# EAGLE schematic FPGA_APU (EAGLE 9.6.2)
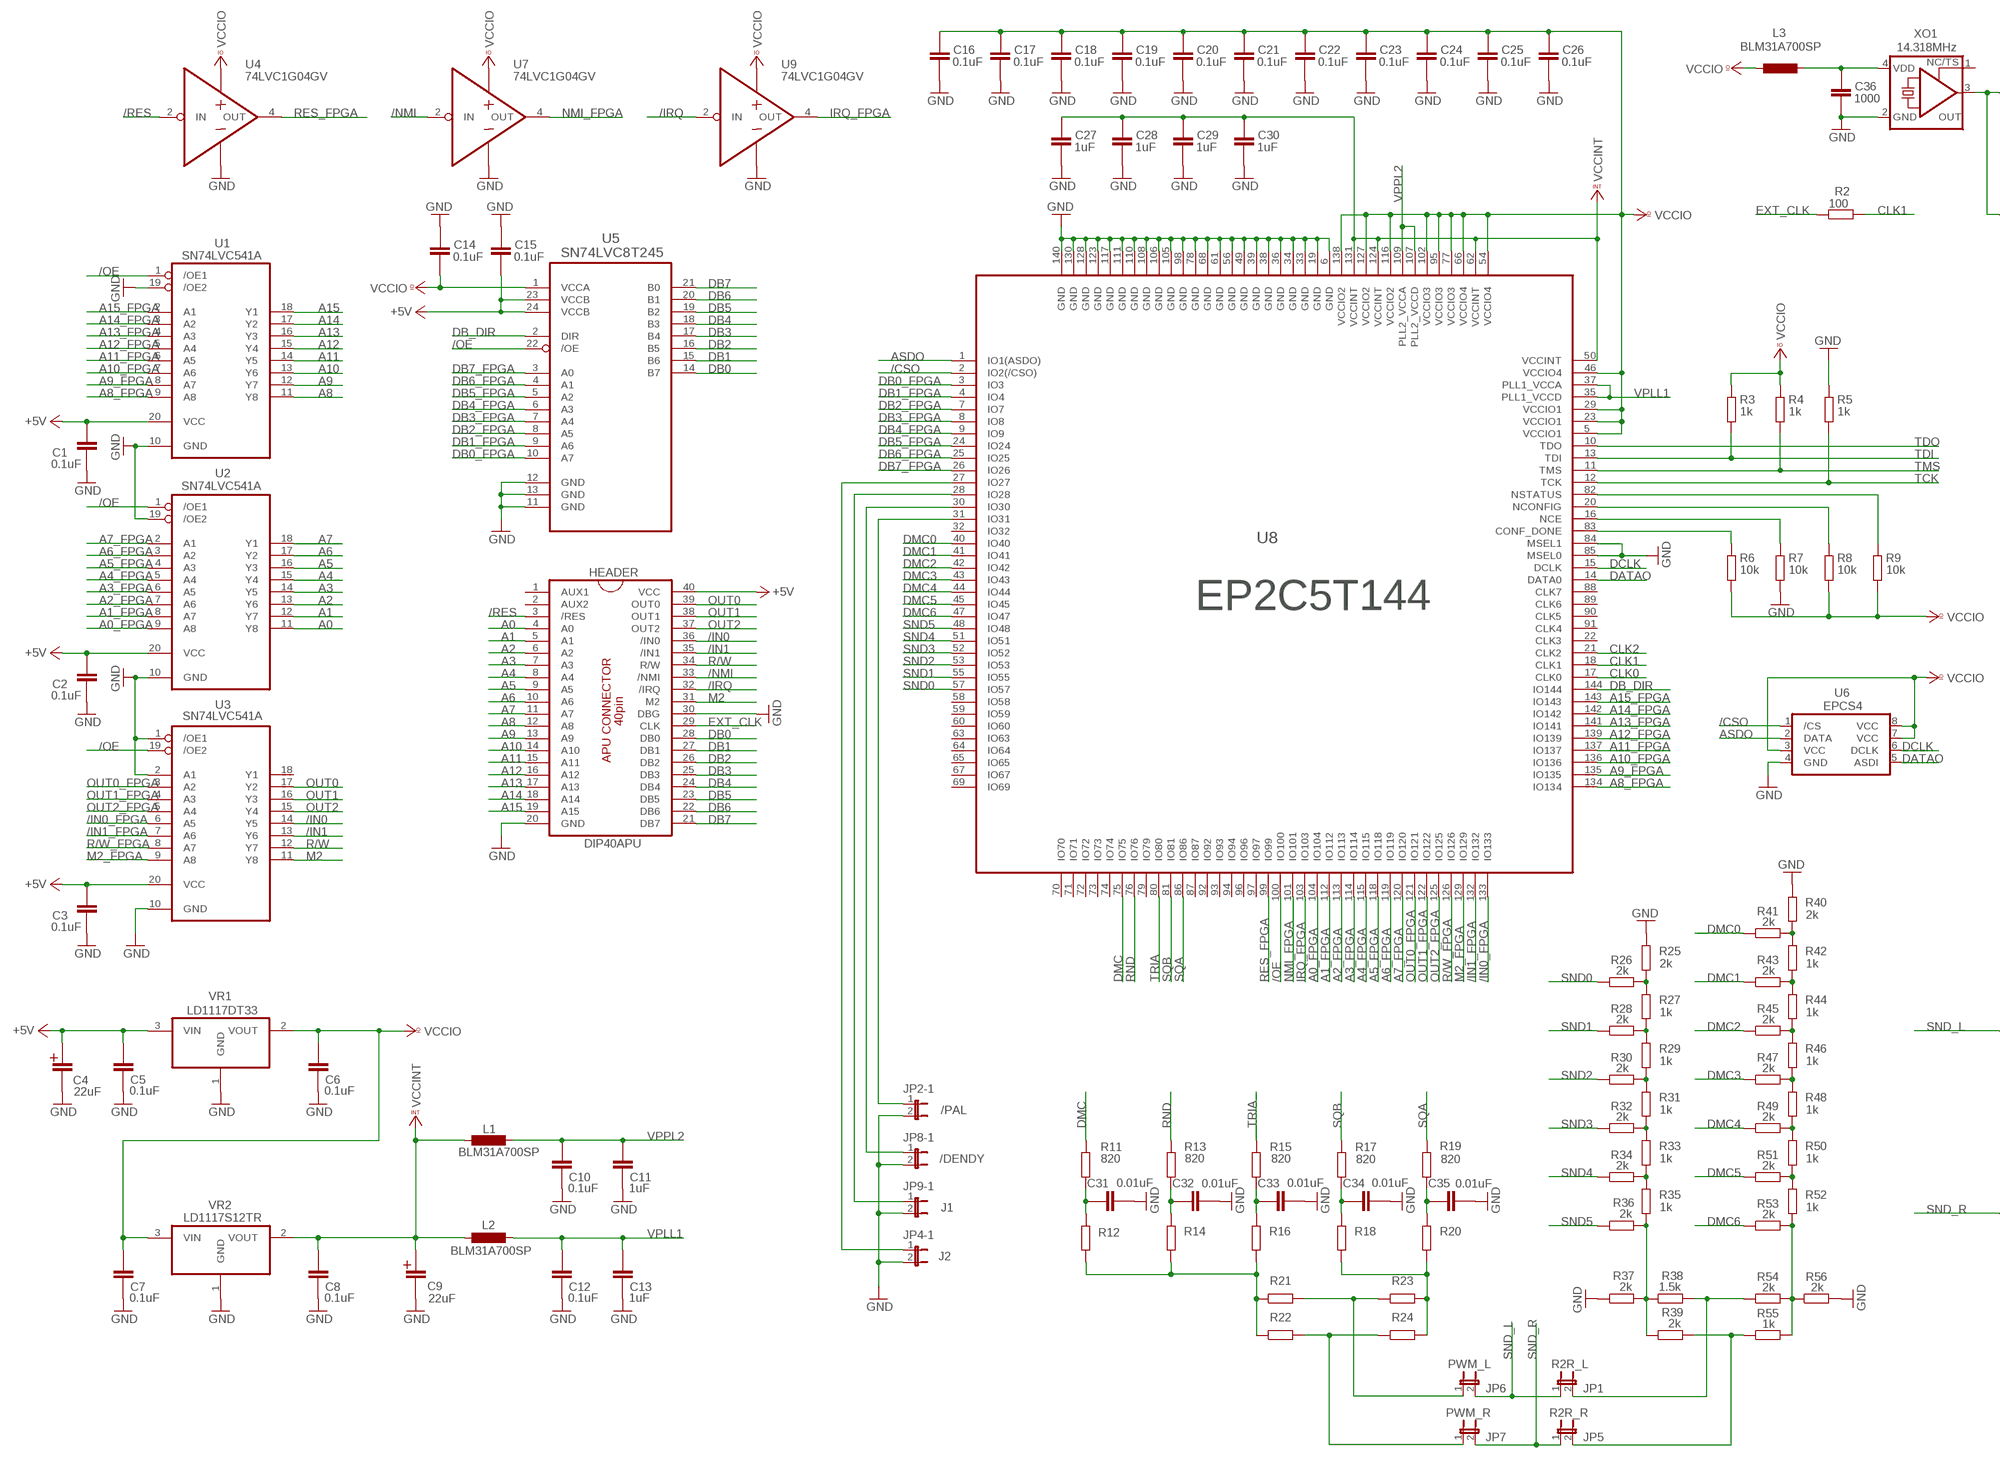
[diagram p0: schematic, sheet 1, part 1 of 2]
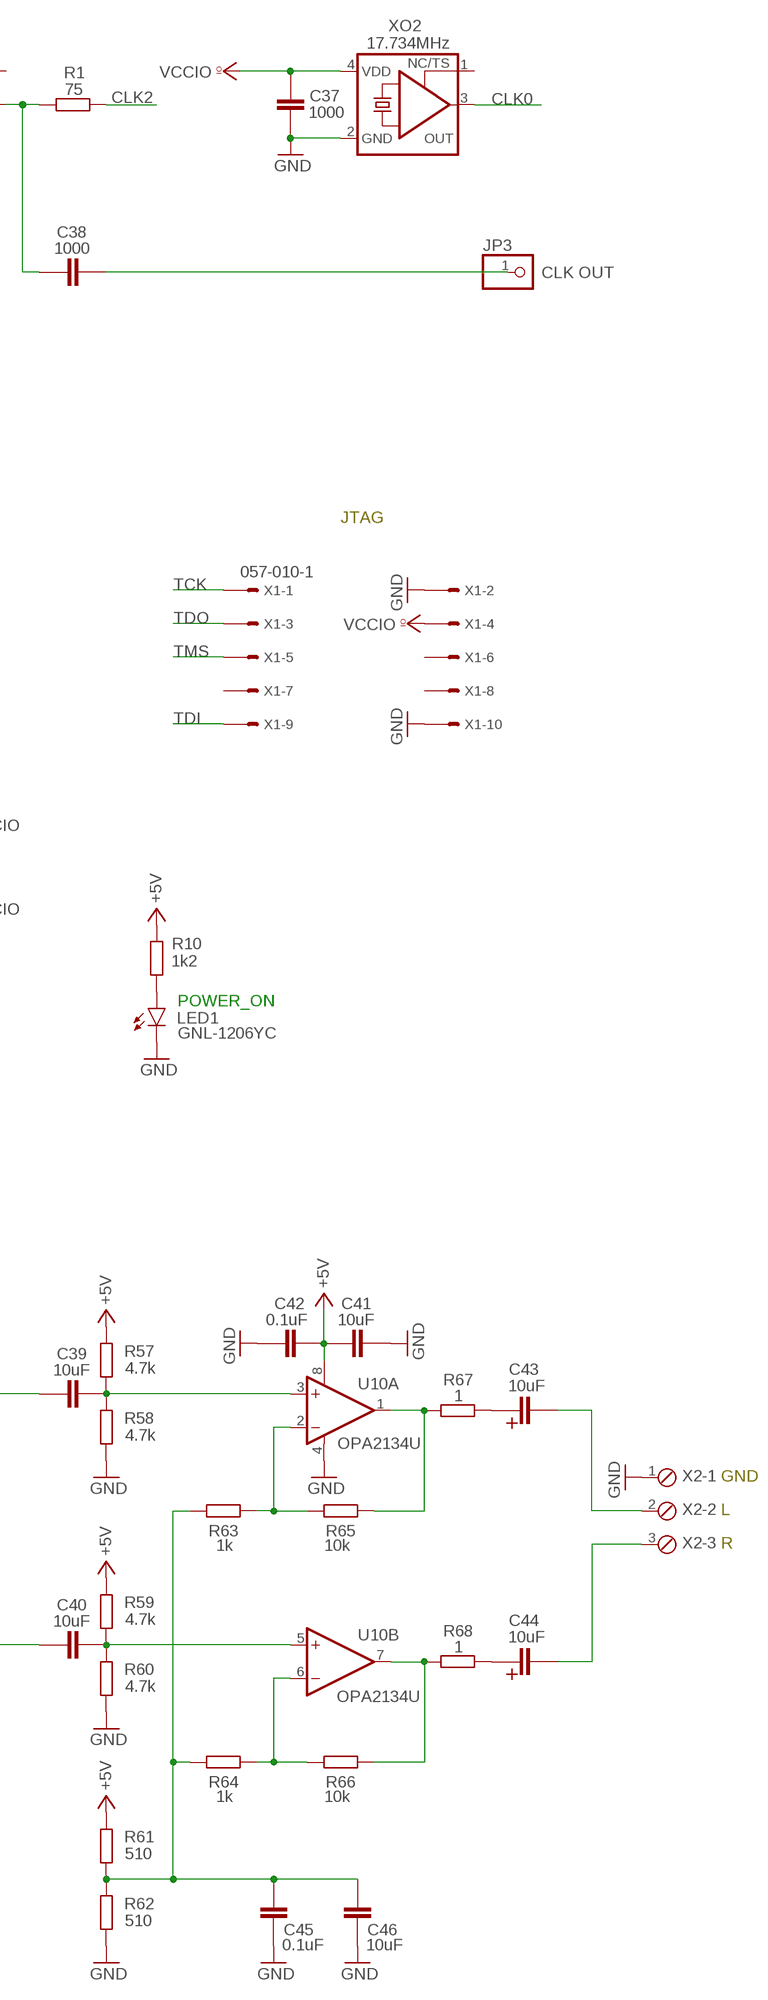
[diagram p1: schematic, sheet 1, part 2 of 2]

## Parts
C1  0.1uF  C-EUC0805  [C0805]
C2  0.1uF  C-EUC0805  [C0805]
C3  0.1uF  C-EUC0805  [C0805]
C4  22uF  CPOL-EU153CLV-0505  [153CLV-0505]
C5  0.1uF  C-EUC0805  [C0805]
C6  0.1uF  C-EUC0805  [C0805]
C7  0.1uF  C-EUC0805  [C0805]
C8  0.1uF  C-EUC0805  [C0805]
C9  22uF  CPOL-EU153CLV-0505  [153CLV-0505]
C10  0.1uF  C-EUC0805  [C0805]
C11  1uF  C-EUC0805  [C0805]
C12  0.1uF  C-EUC0805  [C0805]
C13  1uF  C-EUC0805  [C0805]
C14  0.1uF  C-EUC0805  [C0805]
C15  0.1uF  C-EUC0805  [C0805]
C16  0.1uF  C-EUC0805  [C0805]
C17  0.1uF  C-EUC0805  [C0805]
C18  0.1uF  C-EUC0805  [C0805]
C19  0.1uF  C-EUC0805  [C0805]
C20  0.1uF  C-EUC0805  [C0805]
C21  0.1uF  C-EUC0805  [C0805]
C22  0.1uF  C-EUC0805  [C0805]
C23  0.1uF  C-EUC0805  [C0805]
C24  0.1uF  C-EUC0805  [C0805]
C25  0.1uF  C-EUC0805  [C0805]
C26  0.1uF  C-EUC0805  [C0805]
C27  1uF  C-EUC0805  [C0805]
C28  1uF  C-EUC0805  [C0805]
C29  1uF  C-EUC0805  [C0805]
C30  1uF  C-EUC0805  [C0805]
C31  0.01uF  C-EUC0805  [C0805]
C32  0.01uF  C-EUC0805  [C0805]
C33  0.01uF  C-EUC0805  [C0805]
C34  0.01uF  C-EUC0805  [C0805]
C35  0.01uF  C-EUC0805  [C0805]
C36  1000  C-EUC0805  [C0805]
C37  1000  C-EUC0805  [C0805]
C38  1000  C-EUC0805  [C0805]
C39  10uF  C-EUC0805  [C0805]
C40  10uF  C-EUC0805  [C0805]
C41  10uF  C-EUC0805  [C0805]
C42  0.1uF  C-EUC0805  [C0805]
C43  10uF  CPOL-EU153CLV-0505  [153CLV-0505]
C44  10uF  CPOL-EU153CLV-0505  [153CLV-0505]
C45  0.1uF  C-EUC0805  [C0805]
C46  10uF  C-EUC0805  [C0805]
HEADER  DIP40APU  [DIP-40]
JP1  R2R_L  JP1E  [JP1]
JP2  /PAL  JP4QE  [JP4Q]
JP3  CLK OUT  PINHD-1X1  [1X01]
JP4  J2  JP4QE  [JP4Q]
JP5  R2R_R  JP1E  [JP1]
JP6  PWM_L  JP1E  [JP1]
JP7  PWM_R  JP1E  [JP1]
JP8  /DENDY  JP4QE  [JP4Q]
JP9  J1  JP4QE  [JP4Q]
L1  BLM31A700SP  L-EUL2012C  [L2012C]
L2  BLM31A700SP  L-EUL2012C  [L2012C]
L3  BLM31A700SP  L-EUL2012C  [L2012C]
LED1  GNL-1206YC  LED  [SMARTLED-TTW]
R1  75  R-EU_R0805  [R0805]
R2  100  R-EU_R0805  [R0805]
R3  1k  R-EU_R0805  [R0805]
R4  1k  R-EU_R0805  [R0805]
R5  1k  R-EU_R0805  [R0805]
R6  10k  R-EU_R0805  [R0805]
R7  10k  R-EU_R0805  [R0805]
R8  10k  R-EU_R0805  [R0805]
R9  10k  R-EU_R0805  [R0805]
R10  1k2  R-EU_R0805  [R0805]
R11  820  R-EU_R0805  [R0805]
R12  R-EU_R0805  [R0805]
R13  820  R-EU_R0805  [R0805]
R14  R-EU_R0805  [R0805]
R15  820  R-EU_R0805  [R0805]
R16  R-EU_R0805  [R0805]
R17  820  R-EU_R0805  [R0805]
R18  R-EU_R0805  [R0805]
R19  820  R-EU_R0805  [R0805]
R20  R-EU_R0805  [R0805]
R21  R-EU_R0805  [R0805]
R22  R-EU_R0805  [R0805]
R23  R-EU_R0805  [R0805]
R24  R-EU_R0805  [R0805]
R25  2k  R-EU_R0805  [R0805]
R26  2k  R-EU_R0805  [R0805]
R27  1k  R-EU_R0805  [R0805]
R28  2k  R-EU_R0805  [R0805]
R29  1k  R-EU_R0805  [R0805]
R30  2k  R-EU_R0805  [R0805]
R31  1k  R-EU_R0805  [R0805]
R32  2k  R-EU_R0805  [R0805]
R33  1k  R-EU_R0805  [R0805]
R34  2k  R-EU_R0805  [R0805]
R35  1k  R-EU_R0805  [R0805]
R36  2k  R-EU_R0805  [R0805]
R37  2k  R-EU_R0805  [R0805]
R38  1.5k  R-EU_R0805  [R0805]
R39  2k  R-EU_R0805  [R0805]
R40  2k  R-EU_R0805  [R0805]
R41  2k  R-EU_R0805  [R0805]
R42  1k  R-EU_R0805  [R0805]
R43  2k  R-EU_R0805  [R0805]
R44  1k  R-EU_R0805  [R0805]
R45  2k  R-EU_R0805  [R0805]
R46  1k  R-EU_R0805  [R0805]
R47  2k  R-EU_R0805  [R0805]
R48  1k  R-EU_R0805  [R0805]
R49  2k  R-EU_R0805  [R0805]
R50  1k  R-EU_R0805  [R0805]
R51  2k  R-EU_R0805  [R0805]
R52  1k  R-EU_R0805  [R0805]
R53  2k  R-EU_R0805  [R0805]
R54  2k  R-EU_R0805  [R0805]
R55  1k  R-EU_R0805  [R0805]
R56  2k  R-EU_R0805  [R0805]
R57  4.7k  R-EU_R0805  [R0805]
R58  4.7k  R-EU_R0805  [R0805]
R59  4.7k  R-EU_R0805  [R0805]
R60  4.7k  R-EU_R0805  [R0805]
R61  510  R-EU_R0805  [R0805]
R62  510  R-EU_R0805  [R0805]
R63  1k  R-EU_R0805  [R0805]
R64  1k  R-EU_R0805  [R0805]
R65  10k  R-EU_R0805  [R0805]
R66  10k  R-EU_R0805  [R0805]
R67  1  R-EU_R0805  [R0805]
R68  1  R-EU_R0805  [R0805]
U1  SN74LVC541A  [TSOP20]
U2  SN74LVC541A  [TSOP20]
U3  SN74LVC541A  [TSOP20]
U4  74LVC1G04GV  [SOT95P275X110-5N]
U5  SN74LVC8T245  [SOP65P640X110-24N]
U6  EPCS4  [SO08]
U7  74LVC1G04GV  [SOT95P275X110-5N]
U8  EP2C5T144  [TQFP144]
U9  74LVC1G04GV  [SOT95P275X110-5N]
U10  OPA2134U  [SO08]
VR1  LD1117DT33  [DPAK456P1010X240-3N]
VR2  LD1117S12TR  [SOT-223-3]
X1  057-010-1  [057-010-1]
X2  OUT  MPT7  [7POL254]
XO1  14.318MHz  KXO-PXO/XO-V97  [7.0X5.08_KXO-(V)97]
XO2  17.734MHz  KXO-PXO/XO-V95  [2.5X2.0_KXO-V95]

## Nets
+5V: C1.1 C2.1 C3.1 C4.+ C5.1 C15.2 C41.1 C42.2 HEADER.40(VCC) R10.2 R57.1 R59.1 R61.1 U1.20(VCC) U2.20(VCC) U3.20(VCC) U5.23(VCCB) U5.24(VCCB) U10.8(A:V+) VR1.3(VIN)
/CSO: U6.1(/CS) U8.2(IO2(/CSO))
/IN0: HEADER.36(/IN0) U3.14(Y5)
/IN0_FPGA: U3.6(A5) U8.133(IO133)
/IN1: HEADER.35(/IN1) U3.13(Y6)
/IN1_FPGA: U3.7(A6) U8.132(IO132)
/IRQ: HEADER.32(/IRQ) U9.2(IN)
/NMI: HEADER.33(/NMI) U7.2(IN)
/OE: U1.1(/OE1) U2.1(/OE1) U3.19(/OE2) U5.22(/OE) U8.100(IO100)
/RES: HEADER.3(/RES) U4.2(IN)
A0: HEADER.4(A0) U2.11(Y8)
A0_FPGA: U2.9(A8) U8.104(IO104)
A1: HEADER.5(A1) U2.12(Y7)
A1_FPGA: U2.8(A7) U8.112(IO112)
A2: HEADER.6(A2) U2.13(Y6)
A2_FPGA: U2.7(A6) U8.113(IO113)
A3: HEADER.7(A3) U2.14(Y5)
A3_FPGA: U2.6(A5) U8.114(IO114)
A4: HEADER.8(A4) U2.15(Y4)
A4_FPGA: U2.5(A4) U8.115(IO115)
A5: HEADER.9(A5) U2.16(Y3)
A5_FPGA: U2.4(A3) U8.118(IO118)
A6: HEADER.10(A6) U2.17(Y2)
A6_FPGA: U2.3(A2) U8.119(IO119)
A7: HEADER.11(A7) U2.18(Y1)
A7_FPGA: U2.2(A1) U8.120(IO120)
A8: HEADER.12(A8) U1.11(Y8)
A8_FPGA: U1.9(A8) U8.134(IO134)
A9: HEADER.13(A9) U1.12(Y7)
A9_FPGA: U1.8(A7) U8.135(IO135)
A10: HEADER.14(A10) U1.13(Y6)
A10_FPGA: U1.7(A6) U8.136(IO136)
A11: HEADER.15(A11) U1.14(Y5)
A11_FPGA: U1.6(A5) U8.137(IO137)
A12: HEADER.16(A12) U1.15(Y4)
A12_FPGA: U1.5(A4) U8.139(IO139)
A13: HEADER.17(A13) U1.16(Y3)
A13_FPGA: U1.4(A3) U8.141(IO141)
A14: HEADER.18(A14) U1.17(Y2)
A14_FPGA: U1.3(A2) U8.142(IO142)
A15: HEADER.19(A15) U1.18(Y1)
A15_FPGA: U1.2(A1) U8.143(IO143)
ASDO: U6.2(DATA) U8.1(IO1(ASDO))
CLK0: U8.17(CLK0) XO2.3(OUT)
CLK1: R2.2 U8.18(CLK1)
CLK2: R1.2 U8.21(CLK2)
DATAO: U6.5(ASDI) U8.14(DATA0)
DB0: HEADER.28(DB0) U5.14(B7)
DB0_FPGA: U5.10(A7) U8.3(IO3)
DB1: HEADER.27(DB1) U5.15(B6)
DB1_FPGA: U5.9(A6) U8.4(IO4)
DB2: HEADER.26(DB2) U5.16(B5)
DB2_FPGA: U5.8(A5) U8.7(IO7)
DB3: HEADER.25(DB3) U5.17(B4)
DB3_FPGA: U5.7(A4) U8.8(IO8)
DB4: HEADER.24(DB4) U5.18(B3)
DB4_FPGA: U5.6(A3) U8.9(IO9)
DB5: HEADER.23(DB5) U5.19(B2)
DB5_FPGA: U5.5(A2) U8.24(IO24)
DB6: HEADER.22(DB6) U5.20(B1)
DB6_FPGA: U5.4(A1) U8.25(IO25)
DB7: HEADER.21(DB7) U5.21(B0)
DB7_FPGA: U5.3(A0) U8.26(IO26)
DB_DIR: U5.2(DIR) U8.144(IO144)
DCLK: U6.6(DCLK) U8.15(DCLK)
DMC: R11.1 U8.75(IO75)
DMC0: R41.1 U8.40(IO40)
DMC1: R43.1 U8.41(IO41)
DMC2: R45.1 U8.42(IO42)
DMC3: R47.1 U8.43(IO43)
DMC4: R49.1 U8.44(IO44)
DMC5: R51.1 U8.45(IO45)
DMC6: R53.1 U8.47(IO47)
EXT_CLK: HEADER.29(CLK) R2.1
GND: C1.2 C2.2 C3.2 C4.- C5.2 C6.2 C7.2 C8.2 C9.- C10.2 C11.2 C12.2 C13.2 C14.1 C15.1 C16.2 C17.2 C18.2 C19.2 C20.2 C21.2 C22.2 C23.2 C24.2 C25.2 C26.2 C27.2 C28.2 C29.2 C30.2 C31.2 C32.2 C33.2 C34.2 C35.2 C36.2 C37.2 C41.2 C42.1 C45.2 C46.2 HEADER.20(GND) HEADER.30(DBG) JP2.2 JP4.2 JP8.2 JP9.2 LED1.C@1(C) R5.1 R7.2 R25.1 R37.1 R40.1 R56.2 R58.2 R60.2 R62.2 U1.10(GND) U1.19(/OE2) U2.10(GND) U2.19(/OE2) U3.1(/OE1) U3.2(A1) U3.10(GND) U4.3(GND) U5.11(GND) U5.12(GND) U5.13(GND) U6.4(GND) U7.3(GND) U8.6(GND) U8.19(GND) U8.33(GND) U8.34(GND) U8.36(GND) U8.38(GND) U8.39(GND) U8.49(GND) U8.56(GND) U8.61(GND) U8.68(GND) U8.78(GND) U8.84(MSEL1) U8.85(MSEL0) U8.98(GND) U8.105(GND) U8.106(GND) U8.108(GND) U8.110(GND) U8.111(GND) U8.117(GND) U8.123(GND) U8.128(GND) U8.130(GND) U8.140(GND) U9.3(GND) U10.4(A:V-) VR1.1(GND) VR2.1(GND) X1.2 X1.10 X2.1 XO1.2(GND) XO2.2(GND)
IRQ_FPGA: U8.103(IO103) U9.4(OUT)
M2: HEADER.31(M2) U3.11(Y8)
M2_FPGA: U3.9(A8) U8.129(IO129)
N$1: R25.2 R26.2 R27.1
N$2: C38.2 JP3.1
N$3: R64.2 R66.1 U10.6(B:-IN)
N$4: C43.- X2.2
N$5: LED1.A@1(A) R10.1
N$6: C38.1 R1.1 XO1.3(OUT)
N$7: R7.1 U8.16(NCE)
N$8: JP2.1 U8.31(IO31)
N$9: R27.2 R28.2 R29.1
N$10: R29.2 R30.2 R31.1
N$11: C44.- X2.3
N$12: R31.2 R32.2 R33.1
N$13: R33.2 R34.2 R35.1
N$14: JP8.1 U8.30(IO30)
N$15: JP9.1 U8.28(IO28)
N$16: JP4.1 U8.27(IO27)
N$17: R40.2 R41.2 R42.1
N$18: R42.2 R43.2 R44.1
N$19: R52.2 R53.2 R54.2 R55.2 R56.1
N$20: R9.1 U8.82(NSTATUS)
N$21: R8.1 U8.20(NCONFIG)
N$22: R6.1 U8.83(CONF_DONE)
N$23: R44.2 R45.2 R46.1
N$24: C36.1 L3.2 XO1.4(VDD)
N$25: R46.2 R47.2 R48.1
N$26: R48.2 R49.2 R50.1
N$27: R50.2 R51.2 R52.1
N$28: JP1.2 R38.2 R54.1
N$29: JP5.2 R39.2 R55.1
N$31: R35.2 R36.2 R37.2 R38.1 R39.1
N$32: C31.1 R11.2 R12.1
N$33: R12.2 R14.2 R16.2 R21.1 R22.1
N$34: C32.1 R13.2 R14.1
N$35: R18.2 R20.2 R23.2 R24.2
N$36: C33.1 R15.2 R16.1
N$37: C43.+ R67.2
N$38: C34.1 R17.2 R18.1
N$39: JP6.1 R21.2 R23.1
N$40: C35.1 R19.2 R20.1
N$41: JP7.1 R22.2 R24.1
N$42: R63.2 R65.1 U10.2(A:-IN)
N$43: R65.2 R67.1 U10.1(A:OUT)
N$44: R66.2 R68.1 U10.7(B:OUT)
N$46: C39.2 R57.2 R58.1 U10.3(A:+IN)
N$47: C40.2 R59.2 R60.1 U10.5(B:+IN)
N$48: C44.+ R68.2
NMI_FPGA: U7.4(OUT) U8.101(IO101)
OUT0: HEADER.39(OUT0) U3.17(Y2)
OUT0_FPGA: U3.3(A2) U8.121(IO121)
OUT1: HEADER.38(OUT1) U3.16(Y3)
OUT1_FPGA: U3.4(A3) U8.122(IO122)
OUT2: HEADER.37(OUT2) U3.15(Y4)
OUT2_FPGA: U3.5(A4) U8.125(IO125)
R/W: HEADER.34(R/W) U3.12(Y7)
R/W_FPGA: U3.8(A7) U8.126(IO126)
RES_FPGA: U4.4(OUT) U8.99(IO99)
RND: R13.1 U8.76(IO76)
SND0: R26.1 U8.57(IO57)
SND1: R28.1 U8.55(IO55)
SND2: R30.1 U8.53(IO53)
SND3: R32.1 U8.52(IO52)
SND4: R34.1 U8.51(IO51)
SND5: R36.1 U8.48(IO48)
SND_L: C39.1 JP1.1 JP6.2
SND_R: C40.1 JP5.1 JP7.2
SQA: R19.1 U8.86(IO86)
SQB: R17.1 U8.81(IO81)
TCK: R5.2 U8.12(TCK) X1.1
TDI: R3.2 U8.13(TDI) X1.9
TDO: U8.10(TDO) X1.3
TMS: R4.2 U8.11(TMS) X1.5
TRIA: R15.1 U8.80(IO80)
VCCINT: C8.1 C9.+ C27.1 C28.1 C29.1 C30.1 L1.2 L2.1 U8.50(VCCINT) U8.62(VCCINT) U8.124(VCCINT) U8.131(VCCINT) VR2.2(VOUT)
VCCIO: C6.1 C7.1 C14.2 C16.1 C17.1 C18.1 C19.1 C20.1 C21.1 C22.1 C23.1 C24.1 C25.1 C26.1 C37.1 L3.1 R3.1 R4.1 R6.2 R8.2 R9.2 U4.5(VCC) U5.1(VCCA) U6.3(VCC) U6.7(VCC) U6.8(VCC) U7.5(VCC) U8.5(VCCIO1) U8.23(VCCIO1) U8.29(VCCIO1) U8.46(VCCIO4) U8.54(VCCIO4) U8.66(VCCIO4) U8.77(VCCIO3) U8.95(VCCIO3) U8.102(VCCIO3) U8.116(VCCIO2) U8.127(VCCIO2) U8.138(VCCIO2) U9.5(VCC) VR1.2(VOUT) VR2.3(VIN) X1.4 XO2.4(VDD)
VPLL1: C12.1 C13.1 L2.2 U8.35(PLL1_VCCD) U8.37(PLL1_VCCA)
VPPL2: C10.1 C11.1 L1.1 U8.107(PLL2_VCCD) U8.109(PLL2_VCCA)
VPPL3: C45.1 C46.1 R61.2 R62.1 R63.1 R64.1
Unconnected: HEADER.1(AUX1) HEADER.2(AUX2) JP2.3 JP2.4 JP2.5 JP2.6 JP2.7 JP2.8 JP4.3 JP4.4 JP4.5 JP4.6 JP4.7 JP4.8 JP8.3 JP8.4 JP8.5 JP8.6 JP8.7 JP8.8 JP9.3 JP9.4 JP9.5 JP9.6 JP9.7 JP9.8 U3.18(Y1) U8.22(CLK3) U8.32(IO32) U8.58(IO58) U8.59(IO59) U8.60(IO60) U8.63(IO63) U8.64(IO64) U8.65(IO65) U8.67(IO67) U8.69(IO69) U8.70(IO70) U8.71(IO71) U8.72(IO72) U8.73(IO73) U8.74(IO74) U8.79(IO79) U8.87(IO87) U8.88(CLK7) U8.89(CLK6) U8.90(CLK5) U8.91(CLK4) U8.92(IO92) U8.93(IO93) U8.94(IO94) U8.96(IO96) U8.97(IO97) X1.6 X1.7 X1.8 X2.4 X2.5 X2.6 X2.7 XO1.1(TS) XO2.1(TS)

## Notes on the sheet
- JTAG
- POWER_ON
- GND
- L
- R

## Library data of the parts
C1-C3 C5-C8 C10-C42 C45 C46 = rcl_my:C-EU: CAPACITOR, European symbol; SPICEPREFIX: C
C4 C9 C43 C44 = rcl_my:CPOL-EU: POLARIZED CAPACITOR, European symbol; SPICEPREFIX: C
HEADER = SnapEDA-Library:DIP40APU
JP1 JP5-JP7 = jumper:JP1E: JUMPER
JP2 JP4 JP8 JP9 = jumper:JP4QE: JUMPER
JP3 = pinhead:PINHD-1X1: PIN HEADER
L1-L3 = rcl:L-EU: INDUCTOR, European symbol; SPICEPREFIX: L
LED1 = led:LED: LED OSRAM: - CHIPLED LG R971, LG N971, LY N971, LG Q971, LY Q971, LO R971, LY R971 LH N974, LH R974 LS Q976, LO Q976, LY Q976 LO Q996 - Hyper CHIPLED LW Q18S LB Q993, LB Q99A, LB R99A - SideLED LS A670, LO A670, LY A670, LG A670, LP A670 LB A673, LV A673, LT A673, LW A673 LH A674 LY A675 LS A676, LA A676, LO A676, LY A676, LW A676 LS A679, LY A679, LG A679 - Hyper Micro SIDELED® LS Y876, LA Y876, LO Y876, LY Y876 LT Y87S - SmartLED LW L88C, LW L88S LB L89C, LB L89S, LG L890 LS L89K, LO L89K, LY L89K LS L896, LA L896, LO L896, LY L896 - TOPLED LS T670, LO T670, LY T670, LG T670, LP T670 LSG T670, LSP T670, LSY T670, LOP T670, LYG T670 LG T671, LOG T671, LSG T671 LB T673, LV T673, LT T673, LW T673 LH T674 LS T676, LA T676, LO T676, LY T676, LB T676, LH T676, LSB T676, LW T676 LB T67C, LV T67C, LT T67C, LS T67K, LO T67K, LY T67K, LW E67C LS E67B, LA E67B, LO E67B, LY E67B, LB E67C, LV E67C, LT E67C LW T67C LS T679, LY T679, LG T679 LS T770, LO T770, LY T770, LG T770, LP T770 LB T773, LV T773, LT T773, LW T773 LH T774 LS E675, LA E675, LY E675, LS T675 LS T776, LA T776, LO T776, LY T776, LB T776 LHGB T686 LT T68C, LB T68C - Hyper Mini TOPLED® LB M676 - Mini TOPLED Santana® LG M470 LS M47K, LO M47K, LY M47K Source: http://www.osram.convergy.de LUXEON: - LUMILED® LXK2-PW12-R00, LXK2-PW12-S00, LXK2-PW14-U00, LXK2-PW14-V00 LXK2-PM12-R00, LXK2-PM12-S00, LXK2-PM14-U00 LXK2-PE12-Q00, LXK2-PE12-R00, LXK2-PE12-S00, LXK2-PE14-T00, LXK2-PE14-U00 LXK2-PB12-K00, LXK2-PB12-L00, LXK2-PB12-M00, LXK2-PB14-N00, LXK2-PB14-P00, LXK2-PB14-Q00 LXK2-PR12-L00, LXK2-PR12-M00, LXK2-PR14-Q00, LXK2-PR14-R00 LXK2-PD12-Q00, LXK2-PD12-R00, LXK2-PD12-S00 LXK2-PH12-R00, LXK2-PH12-S00 LXK2-PL12-P00, LXK2-PL12-Q00, LXK2-PL12-R00 Source: www.luxeon.com KINGBRIGHT: KA-3528ASYC Source: www.kingbright.com
R1-R68 = rcl:R-EU_: RESISTOR, European symbol; SPICEPREFIX: R
U1-U3 = SnapEDA-Library:SN74LVC541A; PACKAGE: TSSOP-20; SUPPLIER: TI
U4 U7 U9 = 74LVC1G04GV:74LVC1G04GV
U5 = SnapEDA-Library:SN74LVC8T245
U6 = EPCS4:EPCS4
U8 = altera-cyclone-II:EP2C5T144: EP2C5T144 Auto generated by make-symbol-device-package-bsdl.ulp Rev. 19 Tip: Use split-device-symbol.ulp to generate a Device with multiple small symbols! Read HELP. Source: EP2C5T144.BSD; MPN: EP2C5T144C8N; OC_FARNELL: 1453495; OC_NEWARK: 51R0568
U10 = burr-brown:OPA2134: Operational Amplifier; MF: TEXAS INSTRUMENTS; MPN: OPA2134UA; OC_FARNELL: 1206935; OC_NEWARK: 35C1847
VR1 = LD1117DT33:LD1117DT33; MANUFACTURER: STMicroelectronics; PARTREV: 33; STANDARD: IPC7351B
VR2 = LD1117S12TR:LD1117S12TR
X1 = con-panduit:057-010-: CONNECTOR 10-pin series 057 contact pc board low profile headers; OC_FARNELL: unknown; OC_NEWARK: unknown
X2 = con-phoenix-254:MPT7: PHOENIX CONNECTOR; OC_FARNELL: unknown; OC_NEWARK: unknown
XO1 XO2 = crystal-geyer_V1_0:KXO-PXO/XO-V: Clock Oscillator (PXO/XO) MHz : KXO-V - Serie Model Size l/w/h [mm] Frequency Range Frequency Stability Temp. Range [°C] Output AECQ 200 availabel Datasheet KXO-V94 KXO-V94 KXO-V95 KXO-V95 KXO-V96 KXO-V96 KXO-V99 KXO-V99 KXO-97 KXO-V97 KXO-97 - KXO-V97 2.0/1.6/0.80 2.0/1.6/0.80 2.5/2.0/0.82 2.5/2.0/0.82 3.2/2.5/1.2 3.2/2.5/1.2 5.0/3.2/1.2 5.0/3.2/1.2 7.0/5.08/1.3 7.0/5.08/1.3 7.0/5.08/1.3 32,768 kHz 1,0 ~ 80,0 MHz 32,768 kHz 1,0 ~ 70,0 MHz 32,768 kHz 1,0 ~ 156,0 MHz 32,768 kHz 1,0 ~ 200,0 MHz 32,768 kHz 32,768 kHz 1,0 ~ 160,0 MHz ±25 … ±100ppm ±25 … ±100ppm ±25 … ±100ppm ±25 … ±100ppm ±25 … ±100ppm ±25 … ±100ppm ±25 … ±100ppm ±25 … ±100ppm ±25 … ±100ppm ±25 … ±100ppm ±25 … ±100ppm (*) -40°C …+85°C (*) -40°C …+85°C (*) -40°C …+85°C (*) -40°C …+85°C (*) -40°C …+85°C (*) -40°C …+85°C (*) -40°C …+85°C (*) -40°C …+85°C (*) -40°C …+85°C (*) -40°C …+85°C (*) -40°C …+85°C HCMOS HCMOS HCMOS HCMOS HCMOS HCMOS HCMOS HCMOS HCMOS HCMOS HCMOS - - yes yes yes yes - - - - - KXO-V94-kHz.pdf <http://www.geyer-electronic.de/uploads/tx_userartikelfrequenz/GEYER-KXO-V94-kHz.pdf> KXO-V94.pdf <http://www.geyer-electronic.de/uploads/tx_userartikelfrequenz/GEYER-KXO-V94.pdf> KXO-V95-kHz.pdf <http://www.geyer-electronic.de/uploads/tx_userartikelfrequenz/GEYER-KXO-V95-kHz.pdf> KXO-V95.pdf <http://www.geyer-electronic.de/uploads/tx_userartikelfrequenz/GEYER-KXO-V95.pdf> KXO-V96-kHz.pdf <http://www.geyer-electronic.de/uploads/tx_userartikelfrequenz/GEYER-KXO-V96-kHz.pdf> KXO-V96.pdf <http://www.geyer-electronic.de/uploads/tx_userartikelfrequenz/GEYER-KXO-V96.pdf> KXO-V99-kHz.pdf <http://www.geyer-electronic.de/uploads/tx_userartikelfrequenz/GEYER-KXO-V99-kHz.pdf> KXO-V99.pdf <http://www.geyer-electronic.de/uploads/tx_userartikelfrequenz/GEYER-KXO-V99.pdf> KXO-97-kHz.pdf <http://www.geyer-electronic.de/uploads/tx_userartikelfrequenz/GEYER-KXO-97-kHz.pdf> KXO-V97-kHz.pdf <http://www.geyer-electronic.de/uploads/tx_userartikelfrequenz/GEYER-KXO-V97-kHz.pdf> KXO-V97.pdf <http://www.geyer-electronic.de/uploads/tx_userartikelfrequenz/GEYER-KXO-V97.pdf> <http://www.geyer-electronic.de/fileadmin/template/img/logo-geyer-electronic.png> Details see: http://www.geyer-electronic.de/Frequenz-Produkte.9.0.html Created 2016-06-07, Hans Locher 2016 (C) Geyer Quartz Technology Hans Locher KXOV94,KXOV95;KXOV96;KXOV97;KXO97;2016;2520;3225;5032;70508;2,5x2,0;3,2x2,5;5,0x3,2;7,0x5,08;2.5x2.0;3.2x2.5;5.0x3.2;7.0x5.08;